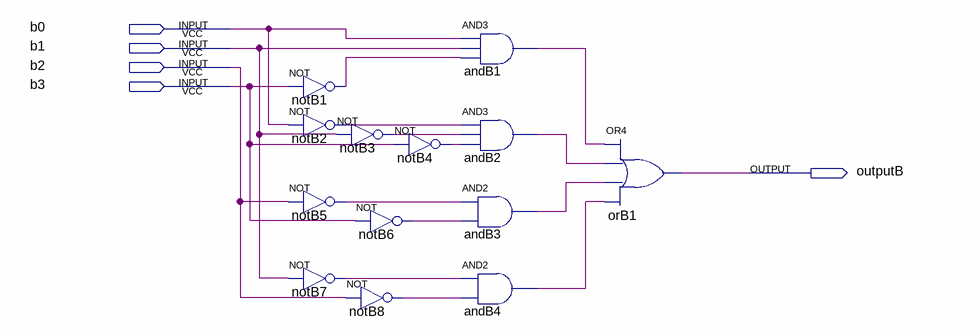
[diagram p0: schematic sheet]
// Quartus schematic b.bdf as structural Verilog: 13 symbols, 5 pins
module b (
  input  b0,
  input  b1,
  input  b2,
  input  b3,
  output outputB
);

  wire andB1_out, andB2_out, andB3_out, andB4_out, notB1_out, notB2_out, notB3_out, notB4_out, notB5_out,
       notB6_out, notB7_out, notB8_out;

  not notB1 (notB1_out, b3);
  not notB2 (notB2_out, b0);
  not notB5 (notB5_out, b2);
  not notB7 (notB7_out, b1);
  not notB3 (notB3_out, b1);
  not notB4 (notB4_out, b3);
  not notB6 (notB6_out, b3);
  not notB8 (notB8_out, b2);
  and andB1 (andB1_out, b0, b1, notB1_out);
  and andB2 (andB2_out, notB2_out, notB3_out, notB4_out);
  and andB3 (andB3_out, notB5_out, notB6_out);
  and andB4 (andB4_out, notB7_out, notB8_out);
  or orB1 (outputB, andB1_out, andB2_out, andB3_out, andB4_out);
endmodule
